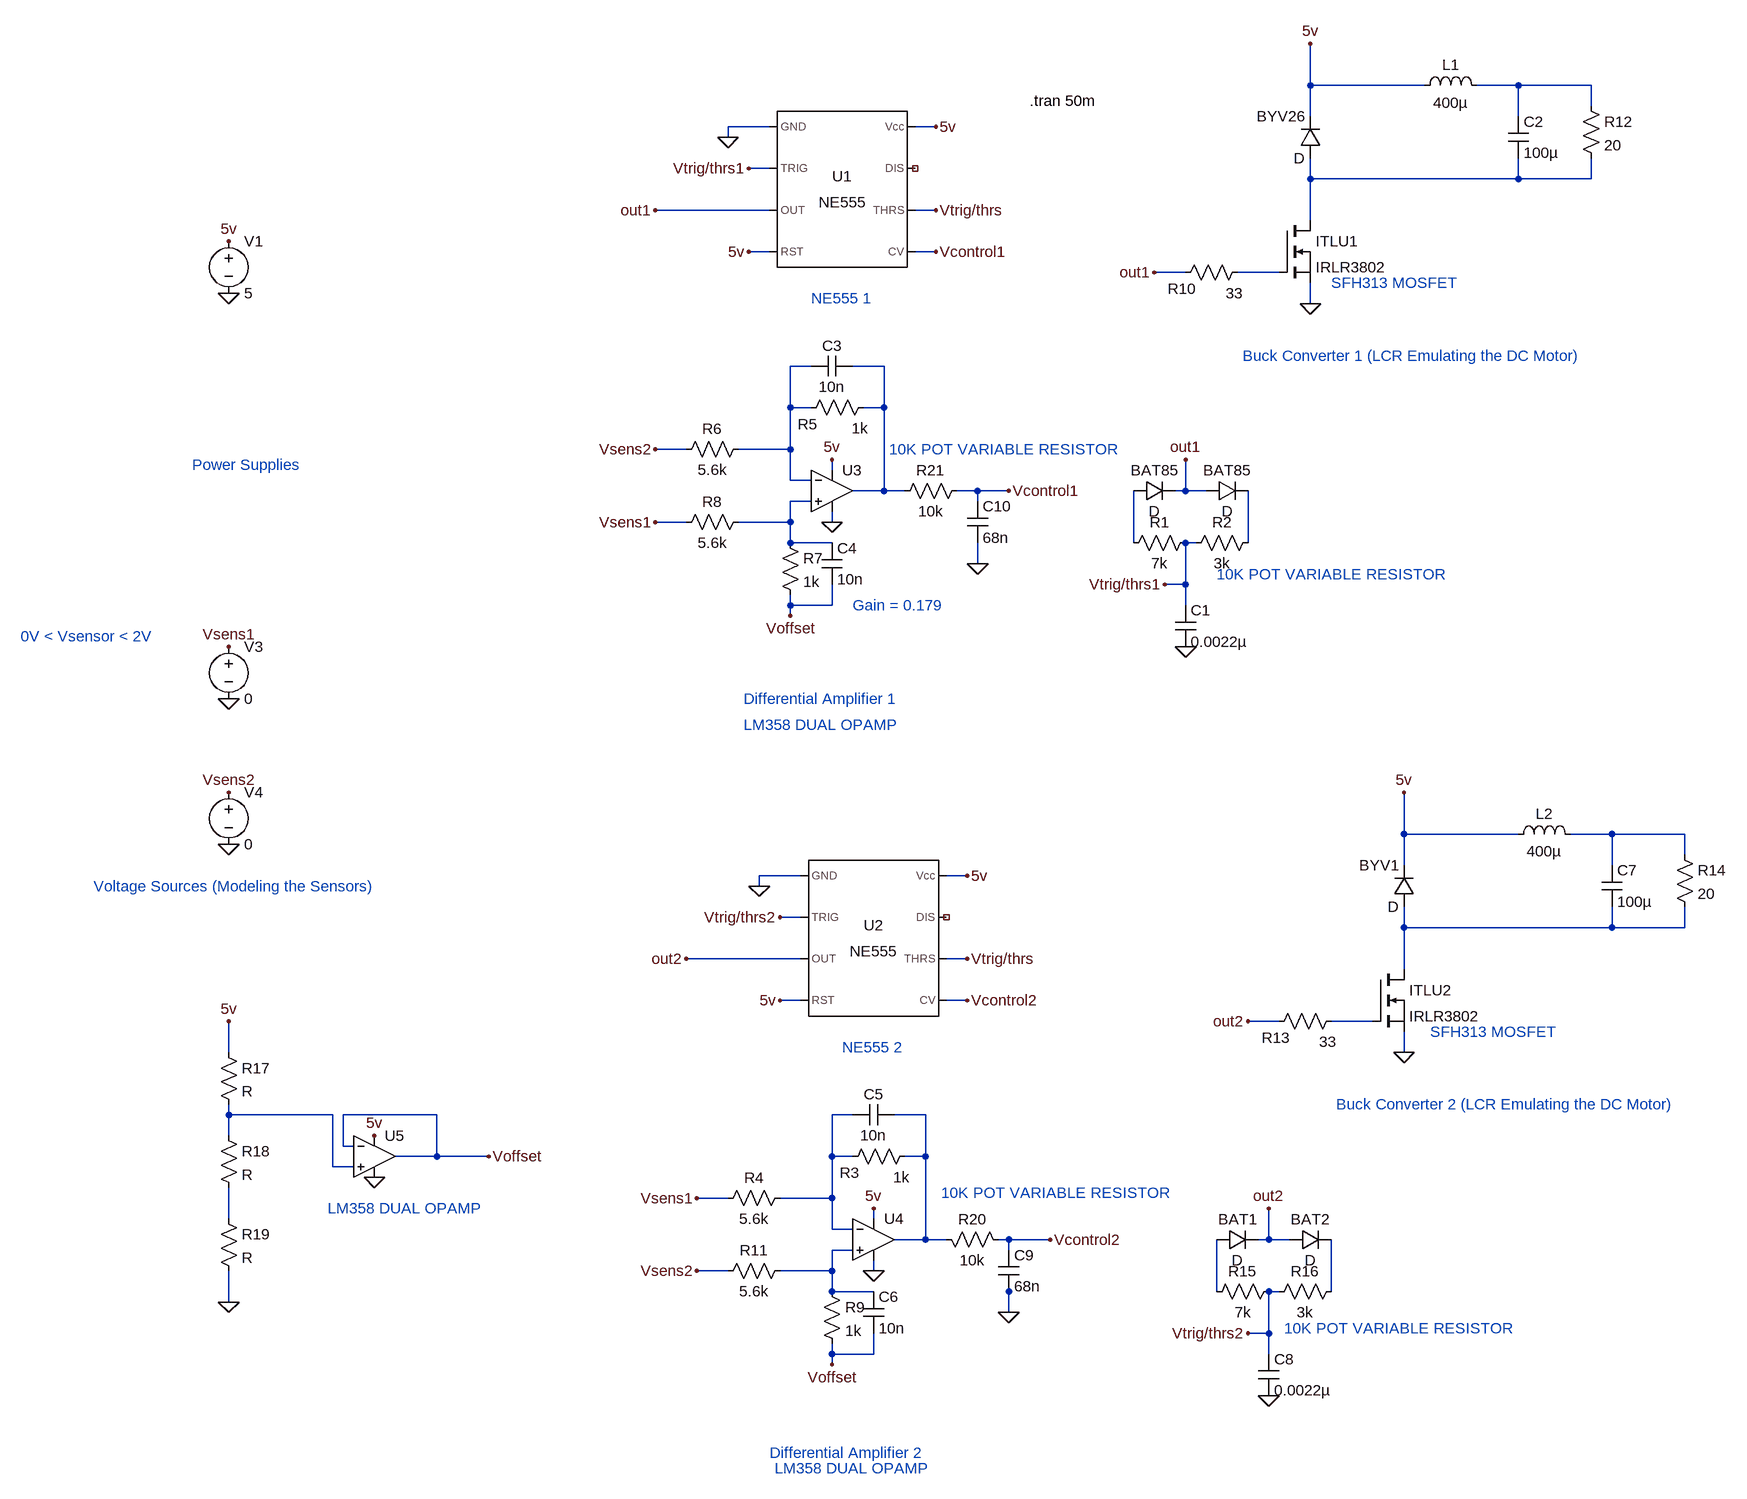
[diagram p0: schematic car circuit.asc]
car circuit.asc, the LTspice schematic file:
Version 4
SHEET 1 1936 2000
WIRE 1088 -144 1088 -208
WIRE 1264 -144 1088 -144
WIRE 1408 -144 1344 -144
WIRE 1520 -144 1408 -144
WIRE 1520 -112 1520 -144
WIRE 1088 -96 1088 -144
WIRE 1408 -96 1408 -144
WIRE 256 -80 192 -80
WIRE 512 -80 480 -80
WIRE 192 -64 192 -80
WIRE 256 -16 224 -16
WIRE 1088 0 1088 -32
WIRE 1408 0 1408 -32
WIRE 1408 0 1088 0
WIRE 1520 0 1520 -32
WIRE 1520 0 1408 0
WIRE 256 48 80 48
WIRE 512 48 480 48
WIRE 1088 64 1088 0
WIRE 256 112 224 112
WIRE 512 112 480 112
WIRE 896 144 848 144
WIRE 1040 144 976 144
WIRE 1088 192 1088 160
WIRE 320 288 288 288
WIRE 432 288 384 288
WIRE 288 352 288 288
WIRE 320 352 288 352
WIRE 432 352 432 288
WIRE 432 352 400 352
WIRE 128 416 80 416
WIRE 288 416 288 352
WIRE 288 416 208 416
WIRE 352 448 352 432
WIRE 288 464 288 416
WIRE 320 464 288 464
WIRE 432 480 432 352
WIRE 432 480 384 480
WIRE 464 480 432 480
WIRE 576 480 544 480
WIRE 624 480 576 480
WIRE 896 480 896 432
WIRE 896 480 880 480
WIRE 928 480 896 480
WIRE 320 496 288 496
WIRE 576 496 576 480
WIRE 128 528 80 528
WIRE 288 528 288 496
WIRE 288 528 208 528
WIRE 352 528 352 512
WIRE 288 560 288 528
WIRE 352 560 288 560
WIRE 816 560 816 480
WIRE 912 560 896 560
WIRE 992 560 992 480
WIRE 576 592 576 560
WIRE 896 624 896 560
WIRE 896 624 864 624
WIRE 288 656 288 640
WIRE 352 656 352 624
WIRE 352 656 288 656
WIRE 896 656 896 624
WIRE 288 672 288 656
WIRE 1232 1008 1232 944
WIRE 1408 1008 1232 1008
WIRE 1552 1008 1488 1008
WIRE 1664 1008 1552 1008
WIRE 1664 1040 1664 1008
WIRE 1232 1056 1232 1008
WIRE 1552 1056 1552 1008
WIRE 304 1072 240 1072
WIRE 560 1072 528 1072
WIRE 240 1088 240 1072
WIRE 304 1136 272 1136
WIRE 1232 1152 1232 1120
WIRE 1552 1152 1552 1120
WIRE 1552 1152 1232 1152
WIRE 1664 1152 1664 1120
WIRE 1664 1152 1552 1152
WIRE 304 1200 128 1200
WIRE 560 1200 528 1200
WIRE 1232 1216 1232 1152
WIRE 304 1264 272 1264
WIRE 560 1264 528 1264
WIRE 1040 1296 992 1296
WIRE 1184 1296 1120 1296
WIRE -576 1344 -576 1296
WIRE 1232 1344 1232 1312
WIRE -576 1440 -576 1424
WIRE -416 1440 -576 1440
WIRE -256 1440 -400 1440
WIRE 384 1440 352 1440
WIRE 496 1440 448 1440
WIRE -576 1472 -576 1440
WIRE -400 1488 -400 1440
WIRE -384 1488 -400 1488
WIRE -256 1504 -256 1440
WIRE -256 1504 -320 1504
WIRE -176 1504 -256 1504
WIRE 352 1504 352 1440
WIRE 384 1504 352 1504
WIRE 496 1504 496 1440
WIRE 496 1504 464 1504
WIRE -416 1520 -416 1440
WIRE -384 1520 -416 1520
WIRE 192 1568 144 1568
WIRE 352 1568 352 1504
WIRE 352 1568 272 1568
WIRE -576 1600 -576 1552
WIRE 416 1600 416 1584
WIRE 352 1616 352 1568
WIRE 384 1616 352 1616
WIRE 496 1632 496 1504
WIRE 496 1632 448 1632
WIRE 528 1632 496 1632
WIRE 624 1632 608 1632
WIRE 688 1632 624 1632
WIRE 1024 1632 1024 1584
WIRE 1024 1632 1008 1632
WIRE 1056 1632 1024 1632
WIRE 384 1648 352 1648
WIRE 624 1648 624 1632
WIRE 192 1680 144 1680
WIRE 352 1680 352 1648
WIRE 352 1680 272 1680
WIRE 416 1680 416 1664
WIRE 352 1712 352 1680
WIRE 416 1712 352 1712
WIRE 624 1712 624 1696
WIRE 944 1712 944 1632
WIRE 1040 1712 1024 1712
WIRE 1120 1712 1120 1632
WIRE -576 1728 -576 1680
WIRE 624 1744 624 1712
WIRE 1024 1776 1024 1712
WIRE 1024 1776 992 1776
WIRE 352 1808 352 1792
WIRE 416 1808 416 1776
WIRE 416 1808 352 1808
WIRE 1024 1808 1024 1776
WIRE 352 1824 352 1808
FLAG -576 96 5v
FLAG -576 176 0
FLAG 192 -64 0
FLAG 224 112 5v
FLAG 512 -80 5v
FLAG -576 720 Vsens1
FLAG -576 800 0
FLAG -576 944 Vsens2
FLAG -576 1024 0
FLAG 352 528 0
FLAG 352 432 5v
FLAG 80 528 Vsens1
FLAG 80 416 Vsens2
FLAG 1088 192 0
FLAG 1088 -208 5v
FLAG 896 720 0
FLAG 896 432 out1
FLAG 80 48 out1
FLAG 848 144 out1
FLAG 224 -16 Vtrig/thrs1
FLAG 512 48 Vtrig/thrs
FLAG 864 624 Vtrig/thrs1
FLAG 624 480 Vcontrol1
FLAG 512 112 Vcontrol1
FLAG 288 672 Voffset
FLAG 240 1088 0
FLAG 272 1264 5v
FLAG 560 1072 5v
FLAG 128 1200 out2
FLAG 272 1136 Vtrig/thrs2
FLAG 560 1200 Vtrig/thrs
FLAG 560 1264 Vcontrol2
FLAG 416 1680 0
FLAG 416 1584 5v
FLAG 144 1680 Vsens2
FLAG 144 1568 Vsens1
FLAG 352 1824 Voffset
FLAG 1232 1344 0
FLAG 1232 944 5v
FLAG 992 1296 out2
FLAG 1024 1872 0
FLAG 1024 1584 out2
FLAG 992 1776 Vtrig/thrs2
FLAG -576 1728 0
FLAG -576 1296 5v
FLAG -176 1504 Voffset
FLAG -352 1472 5v
FLAG -352 1536 0
FLAG 624 1744 0
FLAG 688 1632 Vcontrol2
FLAG 576 592 0
SYMBOL Misc/NE555 368 16 R0
SYMATTR InstName U1
SYMBOL voltage -576 80 R0
WINDOW 123 0 0 Left 2
WINDOW 39 0 0 Left 2
SYMATTR InstName V1
SYMATTR Value 5
SYMBOL voltage -576 704 R0
WINDOW 123 0 0 Left 2
WINDOW 39 0 0 Left 2
SYMATTR InstName V3
SYMATTR Value 0
SYMBOL voltage -576 928 R0
WINDOW 123 0 0 Left 2
WINDOW 39 0 0 Left 2
SYMATTR InstName V4
SYMATTR Value 0
SYMBOL Opamps/UniversalOpamp2 352 480 R0
SYMATTR InstName U3
SYMBOL res 416 336 R90
WINDOW 0 57 101 VBottom 2
WINDOW 3 32 21 VTop 2
SYMATTR InstName R5
SYMATTR Value 1k
SYMBOL res 224 400 R90
WINDOW 0 0 56 VBottom 2
WINDOW 3 32 56 VTop 2
SYMATTR InstName R6
SYMATTR Value 5.6k
SYMBOL res 272 544 R0
SYMATTR InstName R7
SYMATTR Value 1k
SYMBOL res 224 512 R90
WINDOW 0 0 56 VBottom 2
WINDOW 3 32 56 VTop 2
SYMATTR InstName R8
SYMATTR Value 5.6k
SYMBOL res 992 128 R90
WINDOW 0 57 101 VBottom 2
WINDOW 3 32 21 VTop 2
SYMATTR InstName R10
SYMATTR Value 33
SYMBOL nmos 1040 64 R0
SYMATTR InstName ITLU1
SYMATTR Value IRLR3802
SYMBOL diode 1104 -32 R180
WINDOW 0 24 64 Left 2
WINDOW 3 24 0 Left 2
SYMATTR InstName BYV26
SYMBOL ind 1248 -128 R270
WINDOW 0 32 56 VTop 2
WINDOW 3 5 56 VBottom 2
SYMATTR InstName L1
SYMATTR Value 400µ
SYMBOL res 1504 -128 R0
SYMATTR InstName R12
SYMATTR Value 20
SYMBOL cap 1392 -96 R0
SYMATTR InstName C2
SYMATTR Value 100µ
SYMBOL diode 816 496 R270
WINDOW 0 32 32 VTop 2
WINDOW 3 0 32 VBottom 2
SYMATTR InstName BAT85
SYMBOL diode 928 496 R270
WINDOW 0 32 32 VTop 2
WINDOW 3 0 32 VBottom 2
SYMATTR InstName BAT85
SYMBOL res 912 544 R90
WINDOW 0 0 56 VBottom 2
WINDOW 3 32 56 VTop 2
SYMATTR InstName R1
SYMATTR Value 7k
SYMBOL res 1008 544 R90
WINDOW 0 0 56 VBottom 2
WINDOW 3 32 56 VTop 2
SYMATTR InstName R2
SYMATTR Value 3k
SYMBOL cap 880 656 R0
SYMATTR InstName C1
SYMATTR Value 0.0022µ
SYMBOL cap 320 304 R270
WINDOW 0 32 32 VTop 2
WINDOW 3 0 32 VBottom 2
SYMATTR InstName C3
SYMATTR Value 10n
SYMBOL cap 336 560 R0
SYMATTR InstName C4
SYMATTR Value 10n
SYMBOL Misc/NE555 416 1168 R0
SYMATTR InstName U2
SYMBOL Opamps/UniversalOpamp2 416 1632 R0
SYMATTR InstName U4
SYMBOL res 480 1488 R90
WINDOW 0 57 101 VBottom 2
WINDOW 3 32 21 VTop 2
SYMATTR InstName R3
SYMATTR Value 1k
SYMBOL res 288 1552 R90
WINDOW 0 0 56 VBottom 2
WINDOW 3 32 56 VTop 2
SYMATTR InstName R4
SYMATTR Value 5.6k
SYMBOL res 336 1696 R0
SYMATTR InstName R9
SYMATTR Value 1k
SYMBOL res 288 1664 R90
WINDOW 0 0 56 VBottom 2
WINDOW 3 32 56 VTop 2
SYMATTR InstName R11
SYMATTR Value 5.6k
SYMBOL cap 384 1456 R270
WINDOW 0 32 32 VTop 2
WINDOW 3 0 32 VBottom 2
SYMATTR InstName C5
SYMATTR Value 10n
SYMBOL cap 400 1712 R0
SYMATTR InstName C6
SYMATTR Value 10n
SYMBOL res 1136 1280 R90
WINDOW 0 57 101 VBottom 2
WINDOW 3 32 21 VTop 2
SYMATTR InstName R13
SYMATTR Value 33
SYMBOL nmos 1184 1216 R0
SYMATTR InstName ITLU2
SYMATTR Value IRLR3802
SYMBOL diode 1248 1120 R180
WINDOW 0 24 64 Left 2
WINDOW 3 24 0 Left 2
SYMATTR InstName BYV1
SYMBOL ind 1392 1024 R270
WINDOW 0 32 56 VTop 2
WINDOW 3 5 56 VBottom 2
SYMATTR InstName L2
SYMATTR Value 400µ
SYMBOL res 1648 1024 R0
SYMATTR InstName R14
SYMATTR Value 20
SYMBOL cap 1536 1056 R0
SYMATTR InstName C7
SYMATTR Value 100µ
SYMBOL diode 944 1648 R270
WINDOW 0 32 32 VTop 2
WINDOW 3 0 32 VBottom 2
SYMATTR InstName BAT1
SYMBOL diode 1056 1648 R270
WINDOW 0 32 32 VTop 2
WINDOW 3 0 32 VBottom 2
SYMATTR InstName BAT2
SYMBOL res 1040 1696 R90
WINDOW 0 0 56 VBottom 2
WINDOW 3 32 56 VTop 2
SYMATTR InstName R15
SYMATTR Value 7k
SYMBOL res 1136 1696 R90
WINDOW 0 0 56 VBottom 2
WINDOW 3 32 56 VTop 2
SYMATTR InstName R16
SYMATTR Value 3k
SYMBOL cap 1008 1808 R0
SYMATTR InstName C8
SYMATTR Value 0.0022µ
SYMBOL res -592 1328 R0
SYMATTR InstName R17
SYMBOL res -592 1456 R0
SYMATTR InstName R18
SYMBOL res -592 1584 R0
SYMATTR InstName R19
SYMBOL Opamps/UniversalOpamp2 -352 1504 R0
SYMATTR InstName U5
SYMBOL res 624 1648 M270
WINDOW 0 32 56 VTop 2
WINDOW 3 0 56 VBottom 2
SYMATTR InstName R20
SYMATTR Value 10k
SYMBOL cap 608 1648 R0
SYMATTR InstName C9
SYMATTR Value 68n
SYMBOL res 448 496 R270
WINDOW 0 32 56 VTop 2
WINDOW 3 0 56 VBottom 2
SYMATTR InstName R21
SYMATTR Value 10k
SYMBOL cap 560 496 R0
SYMATTR InstName C10
SYMATTR Value 68n
TEXT 656 -120 Left 2 !.tran 50m
TEXT 320 184 Left 2 ;NE555 1
TEXT 216 800 Left 2 ;Differential Amplifier 1
TEXT 984 272 Left 2 ;Buck Converter 1 (LCR Emulating the DC Motor)
TEXT -784 1088 Left 2 ;Voltage Sources (Modeling the Sensors)
TEXT -632 440 Left 2 ;Power Supplies
TEXT -896 704 Left 2 ;0V < Vsensor < 2V
TEXT 384 656 Left 2 ;Gain = 0.179
TEXT 368 1336 Left 2 ;NE555 2
TEXT 256 1960 Left 2 ;Differential Amplifier 2
TEXT 1128 1424 Left 2 ;Buck Converter 2 (LCR Emulating the DC Motor)
TEXT -424 1584 Left 2 ;LM358 DUAL OPAMP
TEXT 264 1984 Left 2 ;LM358 DUAL OPAMP
TEXT 216 840 Left 2 ;LM358 DUAL OPAMP
TEXT 1120 160 Left 2 ;SFH313 MOSFET
TEXT 1272 1312 Left 2 ;SFH313 MOSFET
TEXT 944 608 Left 2 ;10K POT VARIABLE RESISTOR
TEXT 1048 1768 Left 2 ;10K POT VARIABLE RESISTOR
TEXT 520 1560 Left 2 ;10K POT VARIABLE RESISTOR
TEXT 440 416 Left 2 ;10K POT VARIABLE RESISTOR

The netlist it stands for:
* car circuit.asc
XU1 0 Vtrig/thrs1 out1 5v Vcontrol1 Vtrig/thrs NC_01 5v NE555  ; pins GND TRIG OUT RST CV THRS DIS Vcc
V1 5v 0 5
V3 Vsens1 0 0
V4 Vsens2 0 0
XU3 N006 N004 5v 0 N005 level.2 Avol=1Meg GBW=10Meg Slew=10Meg ilimit=25m rail=0 Vos=0 phimargin=45 en=0 enk=0 in=0 ink=0 Rin=500Meg  ; pins IN+ IN- V+ V- OUT
R5 N005 N004 1k
R6 N004 Vsens2 5.6k
R7 N006 Voffset 1k
R8 N006 Vsens1 5.6k
R10 N003 out1 33
M§ITLU1 N002 N003 0 0 IRLR3802
D§BYV26 N002 5v D
L1 5v N001 400µ
R12 N001 N002 20
C2 N001 N002 100µ
D§BAT85 N007 out1 D
D§BAT85 out1 N008 D
R1 Vtrig/thrs1 N007 7k
R2 N008 Vtrig/thrs1 3k
C1 Vtrig/thrs1 0 0.0022µ
C3 N004 N005 10n
C4 N006 Voffset 10n
XU2 0 Vtrig/thrs2 out2 5v Vcontrol2 Vtrig/thrs NC_02 5v NE555  ; pins GND TRIG OUT RST CV THRS DIS Vcc
XU4 N016 N013 5v 0 N014 level.2 Avol=1Meg GBW=10Meg Slew=10Meg ilimit=25m rail=0 Vos=0 phimargin=45 en=0 enk=0 in=0 ink=0 Rin=500Meg  ; pins IN+ IN- V+ V- OUT
R3 N014 N013 1k
R4 N013 Vsens1 5.6k
R9 N016 Voffset 1k
R11 N016 Vsens2 5.6k
C5 N013 N014 10n
C6 N016 Voffset 10n
R13 N011 out2 33
M§ITLU2 N010 N011 0 0 IRLR3802
D§BYV1 N010 5v D
L2 5v N009 400µ
R14 N009 N010 20
C7 N009 N010 100µ
D§BAT1 N017 out2 D
D§BAT2 out2 N018 D
R15 Vtrig/thrs2 N017 7k
R16 N018 Vtrig/thrs2 3k
C8 Vtrig/thrs2 0 0.0022µ
R17 5v N012 R
R18 N012 N015 R
R19 N015 0 R
XU5 N012 Voffset 5v 0 Voffset level.2 Avol=1Meg GBW=10Meg Slew=10Meg ilimit=25m rail=0 Vos=0 phimargin=45 en=0 enk=0 in=0 ink=0 Rin=500Meg  ; pins IN+ IN- V+ V- OUT
R20 Vcontrol2 N014 10k
C9 Vcontrol2 0 68n
R21 N005 Vcontrol1 10k
C10 Vcontrol1 0 68n
.model D D
.lib standard.dio
.model NMOS NMOS
.model PMOS PMOS
.lib standard.mos
.tran 50m
* NE555 1
* Differential Amplifier 1
* Buck Converter 1 (LCR Emulating the DC Motor)
* Voltage Sources (Modeling the Sensors)
* Power Supplies
* 0V < Vsensor < 2V
* Gain = 0.179
* NE555 2
* Differential Amplifier 2
* Buck Converter 2 (LCR Emulating the DC Motor)
* LM358 DUAL OPAMP
* LM358 DUAL OPAMP
* LM358 DUAL OPAMP
* SFH313 MOSFET
* SFH313 MOSFET
* 10K POT VARIABLE RESISTOR
* 10K POT VARIABLE RESISTOR
* 10K POT VARIABLE RESISTOR
* 10K POT VARIABLE RESISTOR
.lib NE555.sub
.lib UniversalOpamps2.sub
.backanno
.end